# Altium project esp8266home.PrjPCB
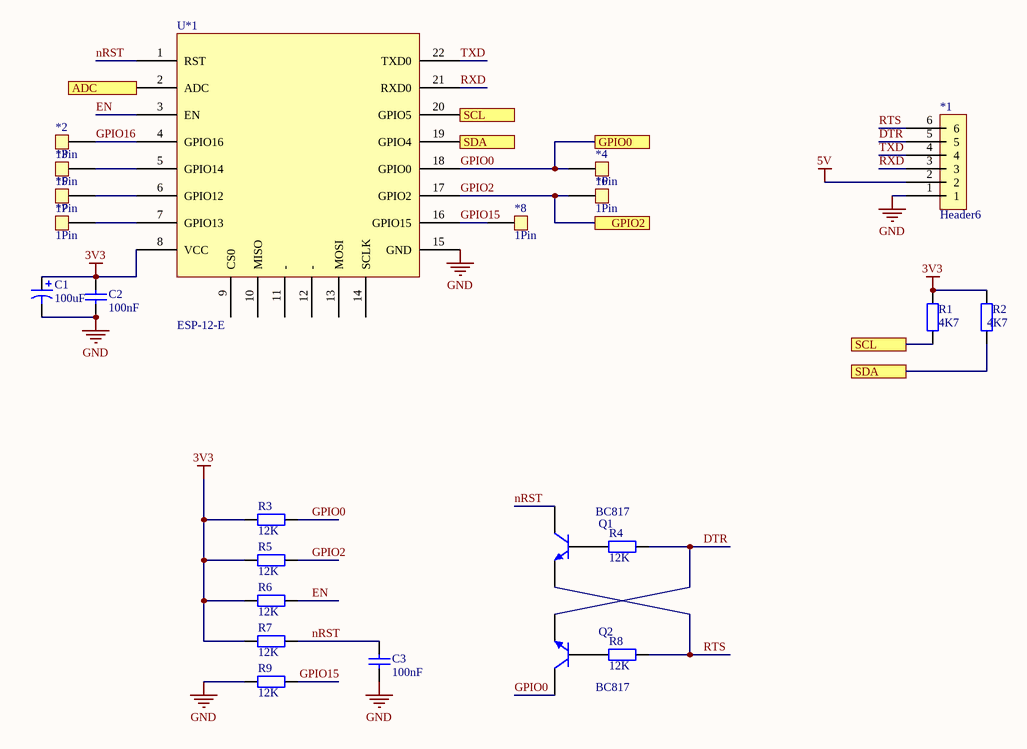
[diagram p0: core.SchDoc]
4 sheets, 173 parts. Net scope: flat (ports and power ports of the same name join across sheets).
Board file: board.PcbDoc
Sheets:
  core.SchDoc
  peripheries.SchDoc
  power.SchDoc
  fetdrivers.SchDoc

## Sheet core.SchDoc
size A4

### Parts
*1  Header6  [HEADER6]
*2  1Pin  [Header1]
*3  1Pin  [Header1]
*4  1Pin  [Header1]
*5  1Pin  [Header1]
*6  1Pin  [Header1]
*7  1Pin  [Header1]
*8  1Pin  [Header1]
C1  100uF  [FP_3528]
C2  100nF  [FP_0805_CAP_085]
C3  100nF  [FP_0805_CAP_085]
Q1  BC817  [FP_SOT23-3]
Q2  BC817  [FP_SOT23-3]
R1  4K7  [FP_0805_RES]
R2  4K7  [FP_0805_RES]
R3  12K  [FP_0805_RES]
R4  12K  [FP_0805_RES]
R5  12K  [FP_0805_RES]
R6  12K  [FP_0805_RES]
R7  12K  [FP_0805_RES]
R8  12K  [FP_0805_RES]
R9  12K  [FP_0805_RES]
U*1  ESP-12-E  [ESP_12_E]

### Ports
ADC, GPIO0, GPIO2, SCL, SDA

### Nets
3V3: C1.P C2.2 R1.2 R2.2 R3.1 R5.1 R6.1 R7.1 U*1.8(VCC)
5V: *1.2
GND: *1.1 C1.N C2.1 C3.1 R9.1 U*1.15(GND)
DTR: *1.5 Q2.2(E) R4.2
EN: R6.2 U*1.3(EN)
GPIO0: *4.1 Q2.3(C) R3.2 U*1.18(GPIO0) ; port GPIO0
GPIO2: *6.1 R5.2 U*1.17(GPIO2) ; port GPIO2
GPIO15: *8.1 R9.2 U*1.16(GPIO15)
GPIO16: *2.1 U*1.4(GPIO16)
nRST: C3.2 Q1.3(C) R7.2 U*1.1(RST)
RTS: *1.6 Q1.2(E) R8.2
RXD: *1.3 U*1.21(RXD0)
TXD: *1.4 U*1.22(TXD0)
Net*3_1: *3.1 U*1.5(GPIO14)
Net*5_1: *5.1 U*1.6(GPIO12)
Net*7_1: *7.1 U*1.7(GPIO13)
Net*_3: R1.1 U*1.20(GPIO5) ; port SCL
Net*_4: R2.1 U*1.19(GPIO4) ; port SDA
NetQ1_1: Q1.1(B) R4.1
NetQ2_1: Q2.1(B) R8.1
NetR16_1: U*1.2(ADC) ; port ADC

Not connected (* = marked no-connect by the designer): U*1 9(CS0) 10(MISO) 11(-) 12(-) 13(MOSI) 14(SCLK)

### Library data of the parts
C1 = CAP_ELECT: Polarized Capacitor; Value: 100uF
C2 = CAP: Capacitor; Value: 100nF
C3 = CAP 100nF: Capacitor; Tolerance: +80%/-20%; Voltage: 25V; Reference: 1759167; Name: SMD Multilayer Ceramic Capacitor, 0805; Supplier: Farnell; Value: 100nF
Q1 Q2 = BC817: NPN General-purpose Transistor; ComponentLink1Description: Manufacturer Link; ComponentLink1URL: http://www.semiconductors.philips.com/; ComponentLink2Description: Datasheet; ComponentLink2URL: http://www.semiconductors.philips.com/acrobat/datasheets/BC817_BC817W_BC337_5.pdf
R1 R2 = RES: Resistor; Value: 4K7
R3-R9 = RES 12K: Resistor; Tolerance: 5%; Power: 125mW; Name: YAGEO (PHYCOMP)  RC0805JR-0712KL  SMD Chip Resistor, Thick Film, 12 kohm; Reference: 9234144; Supplier: Farnell; Value: 12K
U*1 = ESP12-E

## Sheet peripheries.SchDoc
size A4
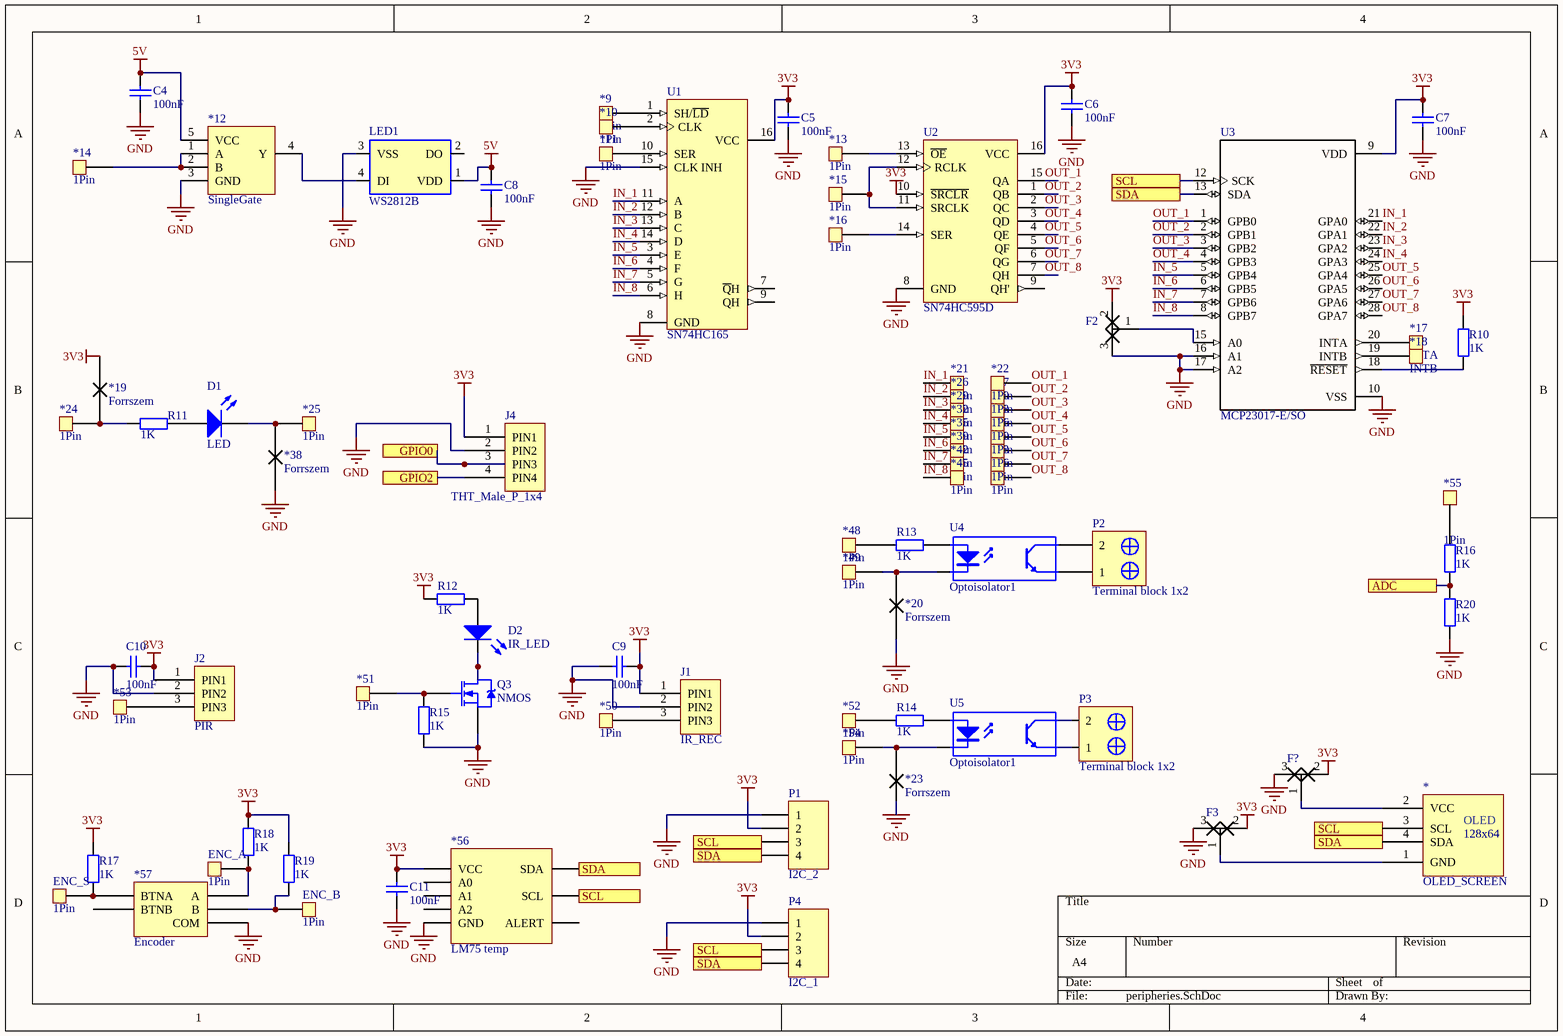
[diagram p1: peripheries.SchDoc]

### Parts
*  OLED_SCREEN  [SCREEN]
*9  1Pin  [Header1]
*10  1Pin  [Header1]
*11  1Pin  [Header1]
*12  SingleGate  [SOT23-5]
*13  1Pin  [Header1]
*14  1Pin  [Header1]
*15  1Pin  [Header1]
*16  1Pin  [Header1]
*17  INTA  [Header1]
*18  INTB  [Header1]
*19  Forrszem  [FORRSZEM]
*20  Forrszem  [FORRSZEM]
*21  1Pin  [Header1]
*22  1Pin  [Header1]
*23  Forrszem  [FORRSZEM]
*24  1Pin  [Header1]
*25  1Pin  [Header1]
*26  1Pin  [Header1]
*27  1Pin  [Header1]
*29  1Pin  [Header1]
*30  1Pin  [Header1]
*32  1Pin  [Header1]
*33  1Pin  [Header1]
*35  1Pin  [Header1]
*36  1Pin  [Header1]
*38  Forrszem  [FORRSZEM]
*39  1Pin  [Header1]
*40  1Pin  [Header1]
*42  1Pin  [Header1]
*43  1Pin  [Header1]
*45  1Pin  [Header1]
*46  1Pin  [Header1]
*48  1Pin  [Header1]
*49  1Pin  [Header1]
*50  1Pin  [Header1]
*51  1Pin  [Header1]
*52  1Pin  [Header1]
*53  1Pin  [Header1]
*54  1Pin  [Header1]
*55  1Pin  [Header1]
*56  LM75 temp  [SO8]
*57  Encoder  [Encoder]
C4  100nF  [FP_0805_CAP_085]
C5  100nF  [FP_0805_CAP_085]
C6  100nF  [FP_0805_CAP_085]
C7  100nF  [FP_0805_CAP_085]
C8  100nF  [FP_0805_CAP_085]
C9  100nF  [FP_0805_CAP_085]
C10  100nF  [FP_0805_CAP_085]
C11  100nF  [FP_0805_CAP_085]
D1  LED  [FP_0805_LED_RED]
D2  IR_LED  [FP_LED_TH_RED]
ENC_A  1Pin  [Header1]
ENC_B  1Pin  [Header1]
ENC_S  1Pin  [Header1]
F2  (no value)  [FORRSZEM3]
F3  Forrszem_2  [FORRSZEM3]  (value not drawn)
F?  Forrszem_2  [FORRSZEM3]  (value not drawn)
J1  IR_REC  [THT_Male_P_1x3-2.54mm]
J2  PIR  [THT_Male_P_1x3-2.54mm]
J4  THT_Male_P_1x4  [THT_Male_P_1x4-2.54mm]
LED1  WS2812B  [PLCC4-LED]
P1  I2C_2  [HDR1X4]
P2  Terminal block 1x2  [Sorkapolcs 1x2 3.5mm PCB]
P3  Terminal block 1x2  [Sorkapolcs 1x2 3.5mm PCB]
P4  I2C_1  [HDR1X4]
Q3  NMOS  [SOT95P245X110-3N]
R10  value 1K  [0805]  (hidden comment: Resistor)
R11  value 1K  [0805]  (hidden comment: Resistor)
R12  value 1K  [0805]  (hidden comment: Resistor)
R13  1K  [FP_0805_RES]
R14  1K  [FP_0805_RES]
R15  value 1K  [0805]  (hidden comment: Resistor)
R16  1K  [FP_0805_RES]
R17  1K  [FP_0805_RES]
R18  1K  [FP_0805_RES]
R19  1K  [FP_0805_RES]
R20  1K  [FP_0805_RES]
U1  SN74HC165  [D016_N]
U2  SN74HC595D  [D016_N]
U3  MCP23017-E/SO  [*SOIC127P1030X265-28N]
U4  Optoisolator1  [DIP-4]
U5  Optoisolator1  [DIP-4]

### Ports
ADC, GPIO0, GPIO2, SCL, SDA

### Nets
3V3: *19.2(B) *56.VCC C5.2 C6.2 C7.2 C9.1 C10.1 C11.2 F2.2(C) F3.2(C) F?.2(C) J1.1(PIN1) J2.1(PIN1) J4.1(PIN1) P1.2 P4.2 R10.1 R12.2 R17.2 R18.2 R19.2 U1.16(VCC) U2.10(~{SRCLR}) U2.16(VCC) U3.9(VDD)
5V: *12.5(VCC) C4.2 C8.2 LED1.1(VDD)
GND: *12.3(GND) *20.1(A) *23.1(A) *38.1(A) *56.GND *57.COM C4.1 C5.1 C6.1 C7.1 C8.1 C9.2 C10.2 C11.1 F2.3(A) F3.3(A) F?.3(A) J1.2(PIN2) J2.2(PIN2) J4.2(PIN2) LED1.3(VSS) P1.1 P4.1 Q3.S R15.1 R20.1 U1.8(GND) U1.15(CLK_INH) U2.8(GND) U3.10(VSS) U3.16(A1) U3.17(A2)
GPIO0: J4.3(PIN3) ; port GPIO0
GPIO2: J4.4(PIN4) ; port GPIO2
IN_1: *21.1 U1.11(A) U3.21(GPA0)
IN_2: *26.1 U1.12(B) U3.22(GPA1)
IN_3: *29.1 U1.13(C) U3.23(GPA2)
IN_4: *32.1 U1.14(D) U3.24(GPA3)
IN_5: *35.1 U1.3(E) U3.5(GPB4)
IN_6: *39.1 U1.4(F) U3.6(GPB5)
IN_7: *42.1 U1.5(G) U3.7(GPB6)
IN_8: *45.1 U1.6(H) U3.8(GPB7)
OUT_1: *22.1 U2.15(QA) U3.1(GPB0)
OUT_2: *27.1 U2.1(QB) U3.2(GPB1)
OUT_3: *30.1 U2.2(QC) U3.3(GPB2)
OUT_4: *33.1 U2.3(QD) U3.4(GPB3)
OUT_5: *36.1 U2.4(QE) U3.25(GPA4)
OUT_6: *40.1 U2.5(QF) U3.26(GPA5)
OUT_7: *43.1 U2.6(QG) U3.27(GPA6)
OUT_8: *46.1 U2.7(QH) U3.28(GPA7)
Net*9_1: *9.1 U1.1(SH/~{LD})
Net*10_1: *10.1 U1.2(CLK)
Net*11_1: *11.1 U1.10(SER)
Net*12_1: *12.1(A) *12.2(B) *14.1
Net*12_4: *12.4(Y) LED1.4(DI)
Net*13_1: *13.1 U2.13(~{OE})
Net*15_1: *15.1 U2.11(SRCLK) U2.12(RCLK)
Net*16_1: *16.1 U2.14(SER)
Net*17_1: *17.1 U3.20(INTA)
Net*18_1: *18.1 U3.19(INTB)
Net*19_1: *19.1(A) *24.1 R11.1
Net*20_2: *20.2(B) *49.1 U4.2(K)
Net*23_2: *23.2(B) *54.1 U5.2(K)
Net*25_1: *25.1 *38.2(B) D1.2(K)
Net*48_1: *48.1 R13.2
Net*50_1: *50.1 J1.3(PIN3)
Net*51_1: *51.1 Q3.G R15.2
Net*52_1: *52.1 R14.2
Net*53_1: *53.1 J2.3(PIN3)
Net*55_1: *55.1 R16.2
Net*57_A: *57.A ENC_A.1 R18.1
Net*57_B: *57.B ENC_B.1 R19.1
Net*57_BTNA: *57.BTNA ENC_S.1 R17.1
Net*_1: *.1(GND) F3.1(B)
Net*_2: *.2(VCC) F?.1(B)
Net*_3: *.3(SCL) *56.SCL P1.3 P4.3 U3.12(SCK) ; port SCL
Net*_4: *.4(SDA) *56.SDA P1.4 P4.4 U3.13(SDA) ; port SDA
NetD1_1: D1.1(A) R11.2
NetD2_1: D2.1(A) R12.1
NetD2_2: D2.2(K) Q3.D
NetF2_1: F2.1(B) U3.15(A0)
NetP2_1: P2.1 U4.3(E)
NetP2_2: P2.2 U4.4(C)
NetP3_1: P3.1 U5.3(E)
NetP3_2: P3.2 U5.4(C)
NetR10_2: R10.2 U3.18(~{RESET})
NetR13_1: R13.1 U4.1(A)
NetR14_1: R14.1 U5.1(A)
NetR16_1: R16.1 R20.2 ; port ADC

Not connected (* = marked no-connect by the designer): *56 A0 A1 A2 ALERT; *57 BTNB; LED1 2(DO); U1 7(~{Q}H) 9(QH); U2 9(QH')

### Notes on the sheet
- (in symbol OLED_SCREEN) OLED; 128x64

### Library data of the parts
*17 *18 = 1Pin
*56 = LM75 temp: pin to pad: A0>7 A1>6 A2>5 ALERT>3 GND>4 SCL>2 SDA>1 VCC>8; Farnell: 8455970; Lomex: 56-04-14
C4-C11 = CAP: Capacitor; Value: 100nF
D1 D2 = LED: Typical RED GaAs LED; pin to pad: 1>A 2>K
F2 = Forrszem_2
J1 J2 = THT_Male_P_1x3: THT Male pin header strip 1x3
J4 = THT_Male_P_1x4: THT Male pin header strip 1x4
LED1 = WS2812B: WorldSemi WS2812B Smart RGB LED; 9.UnitCost: 0.15; 1.Manufacturer: WorldSemi; 2.MfgNo: WS2812B; 3.Supplier: WorldSemi; 4.CatNo: WS2812B
P1 P4 = Header 4: Header, 4-Pin; LatestRevisionDate: 17-Jul-2002; LatestRevisionNote: Re-released for DXP Platform.; Publisher: Altium Limited
P2 P3 = Sorkapocs PCB 1x2 3.5mm
Q3 = NMOS: N-Channel Power MOSFET; pin to pad: D>3 G>1 S>2; Note: Pin 2 is electrically connected to pin 4.; Published: 8-Jun-2000; LatestRevisionDate: 17-Jul-2002; LatestRevisionNote: Re-released for DXP Platform.; DatasheetDocument: PD-9.814; PackageReference: TO-220AB; Publisher: Altium Limited; Code_JEDEC: TO-220-AB; ComponentLink1Description: Manufacturer Link; ComponentLink1URL: http://www.irf.com/
R13 R14 R16-R20 = RES: Resistor; Value: 1K
U1 = SN74HC165: 8-Bit Parallel-Load Shift Register; Published: 8-Jun-2000; LatestRevisionDate: 13-Apr-2006; LatestRevisionNote: IPC-7351 Footprint Added.; DatasheetVersion: May-1997; PackageVersion: Jan-1998; PackageReference: D016; Publisher: Altium Limited; PackageDescription: 16-Pin Small Outline Integrated Circuit 1.27 mm Pitch; Code_IPC: SOIC127P600-16; ComponentLink1Description: Manufacturer Link; ComponentLink1URL: http://www.ti.com/; ComponentLink2Description: Datasheet; ComponentLink2URL: http://www-s.ti.com/sc/ds/sn74hc166.pdf
U2 = SN74HC595D: 8-Bit Shift Register with 3-State Output Registers; Published: 8-Jun-2000; LatestRevisionDate: 13-Apr-2006; LatestRevisionNote: IPC-7351 Footprint Added.; DatasheetVersion: May-1997; PackageVersion: Jan-1998; PackageReference: D016; Publisher: Altium Limited; PackageDescription: 16-Pin Small Outline Integrated Circuit 1.27 mm Pitch; Code_IPC: SOIC127P600-16; ComponentLink1Description: Manufacturer Link; ComponentLink1URL: http://www.ti.com/; ComponentLink2Description: Datasheet; ComponentLink2URL: http://www-s.ti.com/sc/ds/sn74hc595.pdf
U3 = MCP23017-E/SO: MCP23017 Series 5.5 V 1.7 MHz SMT 16-Bit I2C I/O Expander - SOIC-28; MF: Microchip; SnapEDA_Link: https://www.snapeda.com/parts/MCP23017-E/SO/Microchip/view-part/?ref=snap; Price: None; MP: MCP23017-E/SO; Availability: Unavailable; Package: SOIC-28 Microchip; Value: *
U4 U5 = Optoisolator1: 4-Pin Phototransistor Optocoupler; Published: 24-Mar-1999; LatestRevisionDate: 04-Mar-2005; LatestRevisionNote: Sch pins 3 & 4 Swapped.; DatasheetVersion: Nov-2003; PackageReference: DIP-4; Publisher: Altium Limited
R10-R12 R15 = Resistor: Published: 8-Jun-2000; LatestRevisionDate: 17-Jul-2002; LatestRevisionNote: Re-released for DXP Platform.; PackageReference: AXIAL-0.4; Publisher: Altium Limited

## Sheet power.SchDoc
size A4
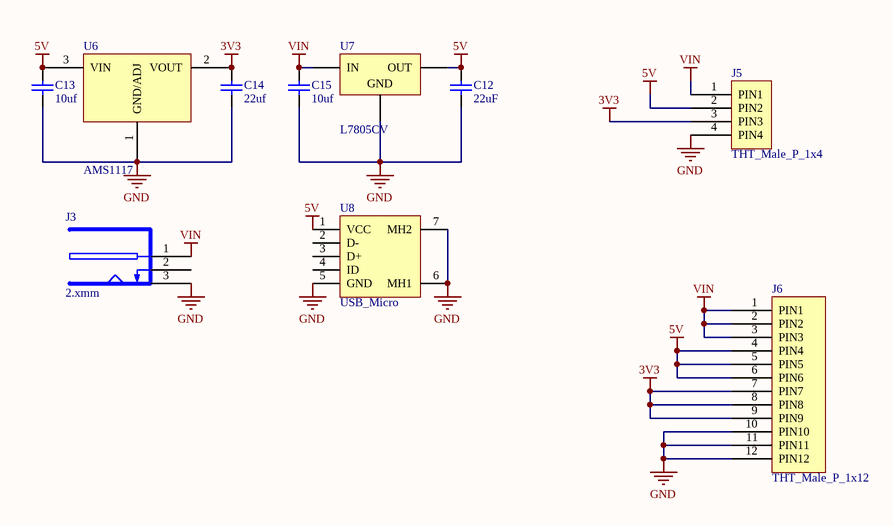
[diagram p2: power.SchDoc]

### Parts
C12  22uF  [1210]
C13  value 10uf  [1210]  (hidden comment: Capacitor)
C14  value 22uf  [1210]  (hidden comment: Capacitor)
C15  10uf  [1210]
J3  2.xmm  [FP_DC_TAP_ANYA]
J5  THT_Male_P_1x4  [THT_Male_P_1x4-2.54mm]
J6  THT_Male_P_1x12  [THT_Male_P_1x12-2.54mm]
U6  AMS1117  [AMS1117-ADJ]
U7  L7805CV  [SOT-223]
U8  USB_Micro  [USB_Micro_Standard]

### Nets
3V3: C14.2 J5.3(PIN3) J6.7(PIN7) J6.8(PIN8) J6.9(PIN9) U6.2(VOUT)
5V: C12.2 C13.2 J5.2(PIN2) J6.4(PIN4) J6.5(PIN5) J6.6(PIN6) U6.3(VIN) U7.OUT U8.1(VCC)
GND: C12.1 C13.1 C14.1 C15.1 J3.3(GND) J5.4(PIN4) J6.10(PIN10) J6.11(PIN11) J6.12(PIN12) U6.1(GND/ADJ) U7.GND U8.5(GND) U8.6(MH1) U8.7(MH2)
VIN: C15.2 J3.1(9V) J5.1(PIN1) J6.1(PIN1) J6.2(PIN2) J6.3(PIN3) U7.IN

Not connected (* = marked no-connect by the designer): J3 2(GND); U8 2(D-) 3(D+) 4(ID)

### Library data of the parts
C12 C15 = CAP: Capacitor
  C12: Value: 22uF
  C15: Value: 10uf
C13 C14 = Capacitor: Ceramic Chip Capacitor - Standard; Note: Footprint corresponds to dimensions for bulk cassette packaging. This case size has tightened tolerances.; Published: 17-Jul-2002; LatestRevisionDate: 19-Mar-2004; LatestRevisionNote: Silkscreen size reduced.; DatasheetDocument: Mar-2001; PackageDocument: Mar-2001; PackageReference: 0805; Publisher: Altium Limited; Code_JEITA: 0805; Code_IPC: 2012[0805]; ComponentLink1Description: Manufacturer Link; ComponentLink1URL: http://www.kemet.com/; ComponentLink2Description: Datasheet; ComponentLink2URL: http://www.kemet.com/kemet/web/homepage/kechome.nsf/vapubfilesname/F3102TA.pdf/$file/F3102TA.pdf
J3 = DC_TAP_ANYA: 2.xmm DC HEBA25 TÁPFESZÜLTSÉG ALJZAT ZÁRT, NYÁKBA 90°; Supplier: Lomex 43-07-67
J5 = THT_Male_P_1x4: THT Male pin header strip 1x4
J6 = THT_Male_P_1x12: THT Male pin header strip 1x12
U6 = AMS1117: AMS1117 1A LOW DROPOUT VOLTAGE REGULATOR
U7 = L7805CV: Positive Voltage Regulator; pin to pad: GND>1 IN>3 OUT>2; Note: Tab is connected to pin 3 (GND).; Published: 24-Aug-2001; LatestRevisionDate: 17-Jul-2002; LatestRevisionNote: Re-released for DXP Platform.; DatasheetVersion: Dec-1998; PackageVersion: Jun-1998; PackageReference: TO220ABN; Publisher: Altium Limited; PackageDescription: TO, Thru-Hole, Vertical, Heatsink Mounted; 3 In-Line Leads; Pitch 2.54 mm; Pin sequence 1, 3, 2; ComponentLink1Description: Manufacturer Link; ComponentLink1URL: http://www.st.com/
U8 = USB_Micro: USB micro female

## Sheet fetdrivers.SchDoc
size A4
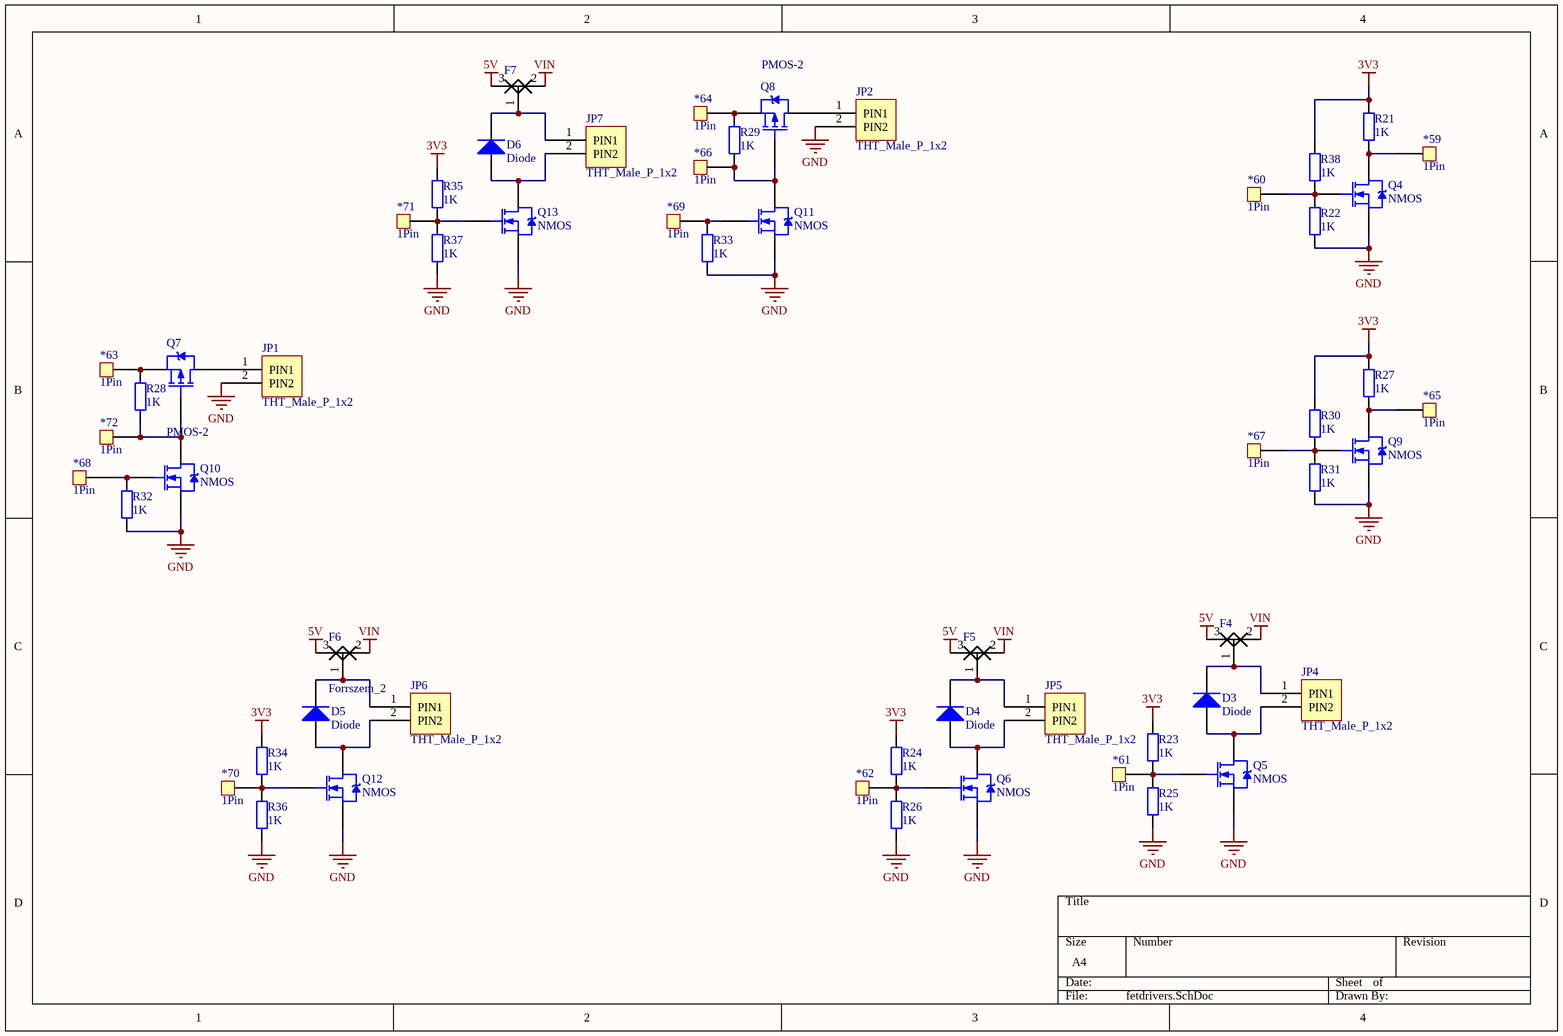
[diagram p3: fetdrivers.SchDoc]

### Parts
*59  1Pin  [Header1]
*60  1Pin  [Header1]
*61  1Pin  [Header1]
*62  1Pin  [Header1]
*63  1Pin  [Header1]
*64  1Pin  [Header1]
*65  1Pin  [Header1]
*66  1Pin  [Header1]
*67  1Pin  [Header1]
*68  1Pin  [Header1]
*69  1Pin  [Header1]
*70  1Pin  [Header1]
*71  1Pin  [Header1]
*72  1Pin  [Header1]
D3  Diode  [DO214]
D4  Diode  [DO214]
D5  Diode  [DO214]
D6  Diode  [DO214]
F4  Forrszem_2  [FORRSZEM3]  (value not drawn)
F5  Forrszem_2  [FORRSZEM3]  (value not drawn)
F6  Forrszem_2  [FORRSZEM3]
F7  Forrszem_2  [FORRSZEM3]  (value not drawn)
JP1  THT_Male_P_1x2  [THT_Male_P_1x2-2.54mm]
JP2  THT_Male_P_1x2  [THT_Male_P_1x2-2.54mm]
JP4  THT_Male_P_1x2  [THT_Male_P_1x2-2.54mm]
JP5  THT_Male_P_1x2  [THT_Male_P_1x2-2.54mm]
JP6  THT_Male_P_1x2  [THT_Male_P_1x2-2.54mm]
JP7  THT_Male_P_1x2  [THT_Male_P_1x2-2.54mm]
Q4  NMOS  [SOT95P245X110-3N]
Q5  NMOS  [SOT95P245X110-3N]
Q6  NMOS  [SOT95P245X110-3N]
Q7  PMOS-2  [SOT95P245X110-3N]
Q8  PMOS-2  [SOT95P245X110-3N]
Q9  NMOS  [SOT95P245X110-3N]
Q10  NMOS  [SOT95P245X110-3N]
Q11  NMOS  [SOT95P245X110-3N]
Q12  NMOS  [SOT95P245X110-3N]
Q13  NMOS  [SOT95P245X110-3N]
R21  value 1K  [0805]  (hidden comment: Resistor)
R22  value 1K  [0805]  (hidden comment: Resistor)
R23  value 1K  [0805]  (hidden comment: Resistor)
R24  value 1K  [0805]  (hidden comment: Resistor)
R25  value 1K  [0805]  (hidden comment: Resistor)
R26  value 1K  [0805]  (hidden comment: Resistor)
R27  value 1K  [0805]  (hidden comment: Resistor)
R28  1K  [FP_0805_RES]
R29  1K  [FP_0805_RES]
R30  value 1K  [0805]  (hidden comment: Resistor)
R31  value 1K  [0805]  (hidden comment: Resistor)
R32  1K  [FP_0805_RES]
R33  1K  [FP_0805_RES]
R34  value 1K  [0805]  (hidden comment: Resistor)
R35  value 1K  [0805]  (hidden comment: Resistor)
R36  value 1K  [0805]  (hidden comment: Resistor)
R37  value 1K  [0805]  (hidden comment: Resistor)
R38  value 1K  [0805]  (hidden comment: Resistor)

### Nets
3V3: R21.2 R23.2 R24.2 R27.2 R30.2 R34.2 R35.2 R38.2
5V: F4.3(A) F5.3(A) F6.3(A) F7.3(A)
GND: JP1.2(PIN2) JP2.2(PIN2) Q4.S Q5.S Q6.S Q9.S Q10.S Q11.S Q12.S Q13.S R22.1 R25.1 R26.1 R31.1 R32.1 R33.1 R36.1 R37.1
VIN: F4.2(C) F5.2(C) F6.2(C) F7.2(C)
Net*59_1: *59.1 Q4.D R21.1
Net*60_1: *60.1 Q4.G R22.2 R38.1
Net*61_1: *61.1 Q5.G R23.1 R25.2
Net*62_1: *62.1 Q6.G R24.1 R26.2
Net*63_1: *63.1 Q7.S R28.2
Net*64_1: *64.1 Q8.S R29.2
Net*65_1: *65.1 Q9.D R27.1
Net*66_1: *66.1 Q8.G Q11.D R29.1
Net*67_1: *67.1 Q9.G R30.1 R31.2
Net*68_1: *68.1 Q10.G R32.2
Net*69_1: *69.1 Q11.G R33.2
Net*70_1: *70.1 Q12.G R34.1 R36.2
Net*71_1: *71.1 Q13.G R35.1 R37.2
Net*72_1: *72.1 Q7.G Q10.D R28.1
NetD3_1: D3.1(A) JP4.2(PIN2) Q5.D
NetD3_2: D3.2(K) F4.1(B) JP4.1(PIN1)
NetD4_1: D4.1(A) JP5.2(PIN2) Q6.D
NetD4_2: D4.2(K) F5.1(B) JP5.1(PIN1)
NetD5_1: D5.1(A) JP6.2(PIN2) Q12.D
NetD5_2: D5.2(K) F6.1(B) JP6.1(PIN1)
NetD6_1: D6.1(A) JP7.2(PIN2) Q13.D
NetD6_2: D6.2(K) F7.1(B) JP7.1(PIN1)
NetJP1_1: JP1.1(PIN1) Q7.D
NetJP2_1: JP2.1(PIN1) Q8.D

### Library data of the parts
JP1 JP2 JP4-JP7 = THT_Male_P_1x2: THT Male pin header strip 1x2
Q4-Q6 Q9-Q13 = NMOS: N-Channel Power MOSFET; pin to pad: D>3 G>1 S>2; Note: Pin 2 is electrically connected to pin 4.; Published: 8-Jun-2000; LatestRevisionDate: 17-Jul-2002; LatestRevisionNote: Re-released for DXP Platform.; DatasheetDocument: PD-9.814; PackageReference: TO-220AB; Publisher: Altium Limited; Code_JEDEC: TO-220-AB; ComponentLink1Description: Manufacturer Link; ComponentLink1URL: http://www.irf.com/
Q7 Q8 = PMOS-2: P-Channel Power MOSFET; pin to pad: D>3 G>1 S>2; Note: Pin 4 not drawn and electrically connected to Pin 2.; Published: 8-Jun-2000; LatestRevisionDate: 17-Jul-2002; LatestRevisionNote: Re-released for DXP Platform.; DatasheetVersion: PD-9.390D; PackageVersion: Feb-1997; PackageReference: TO-220AB; Publisher: Altium Limited; PackageDescription: TO, Thru-Hole, Vertical, Heatsink Mounted; 3 In-Line Leads; Pitch 2.54 mm; ComponentLink1Description: Manufacturer Link; ComponentLink1URL: http://www.irf.com/
R28 R29 R32 R33 = RES: Resistor; Value: 1K
D3-D6 = Diode: Published: 8-Jun-2000; LatestRevisionDate: 17-Jul-2002; LatestRevisionNote: Re-released for DXP Platform.; DatasheetDocument: 6-Aug-1999; PackageReference: DO-35; Publisher: Altium Limited; Code_JEDEC: DO-204-AH; ComponentLink1Description: Manufacturer Link; ComponentLink1URL: http://www.vishay.com/; ComponentLink2Description: Datasheet; ComponentLink2URL: http://www.vishay.com/docs/85588/85588.pdf
R21-R27 R30 R31 R34-R38 = Resistor: Published: 8-Jun-2000; LatestRevisionDate: 17-Jul-2002; LatestRevisionNote: Re-released for DXP Platform.; PackageReference: AXIAL-0.4; Publisher: Altium Limited

## Nets that join several sheets
3V3: core (9 pins), peripheries (25 pins), power (6 pins), fetdrivers (8 pins)
5V: core (*1.2), peripheries (*12.5 C4.2 C8.2 LED1.1), power (9 pins), fetdrivers (F4.3 F5.3 F6.3 F7.3)
GND: core (6 pins), peripheries (32 pins), power (14 pins), fetdrivers (18 pins)
VIN: power (7 pins), fetdrivers (F4.2 F5.2 F6.2 F7.2)
GPIO0: core (*4.1 Q2.3 R3.2 U*1.18), peripheries (J4.3)
GPIO2: core (*6.1 R5.2 U*1.17), peripheries (J4.4)
Net*_3: core (R1.1 U*1.20), peripheries (5 pins)
Net*_4: core (R2.1 U*1.19), peripheries (5 pins)
NetR16_1: core (U*1.2), peripheries (R16.1 R20.2)